# EAGLE design 500uH (EAGLE 9.6.2)
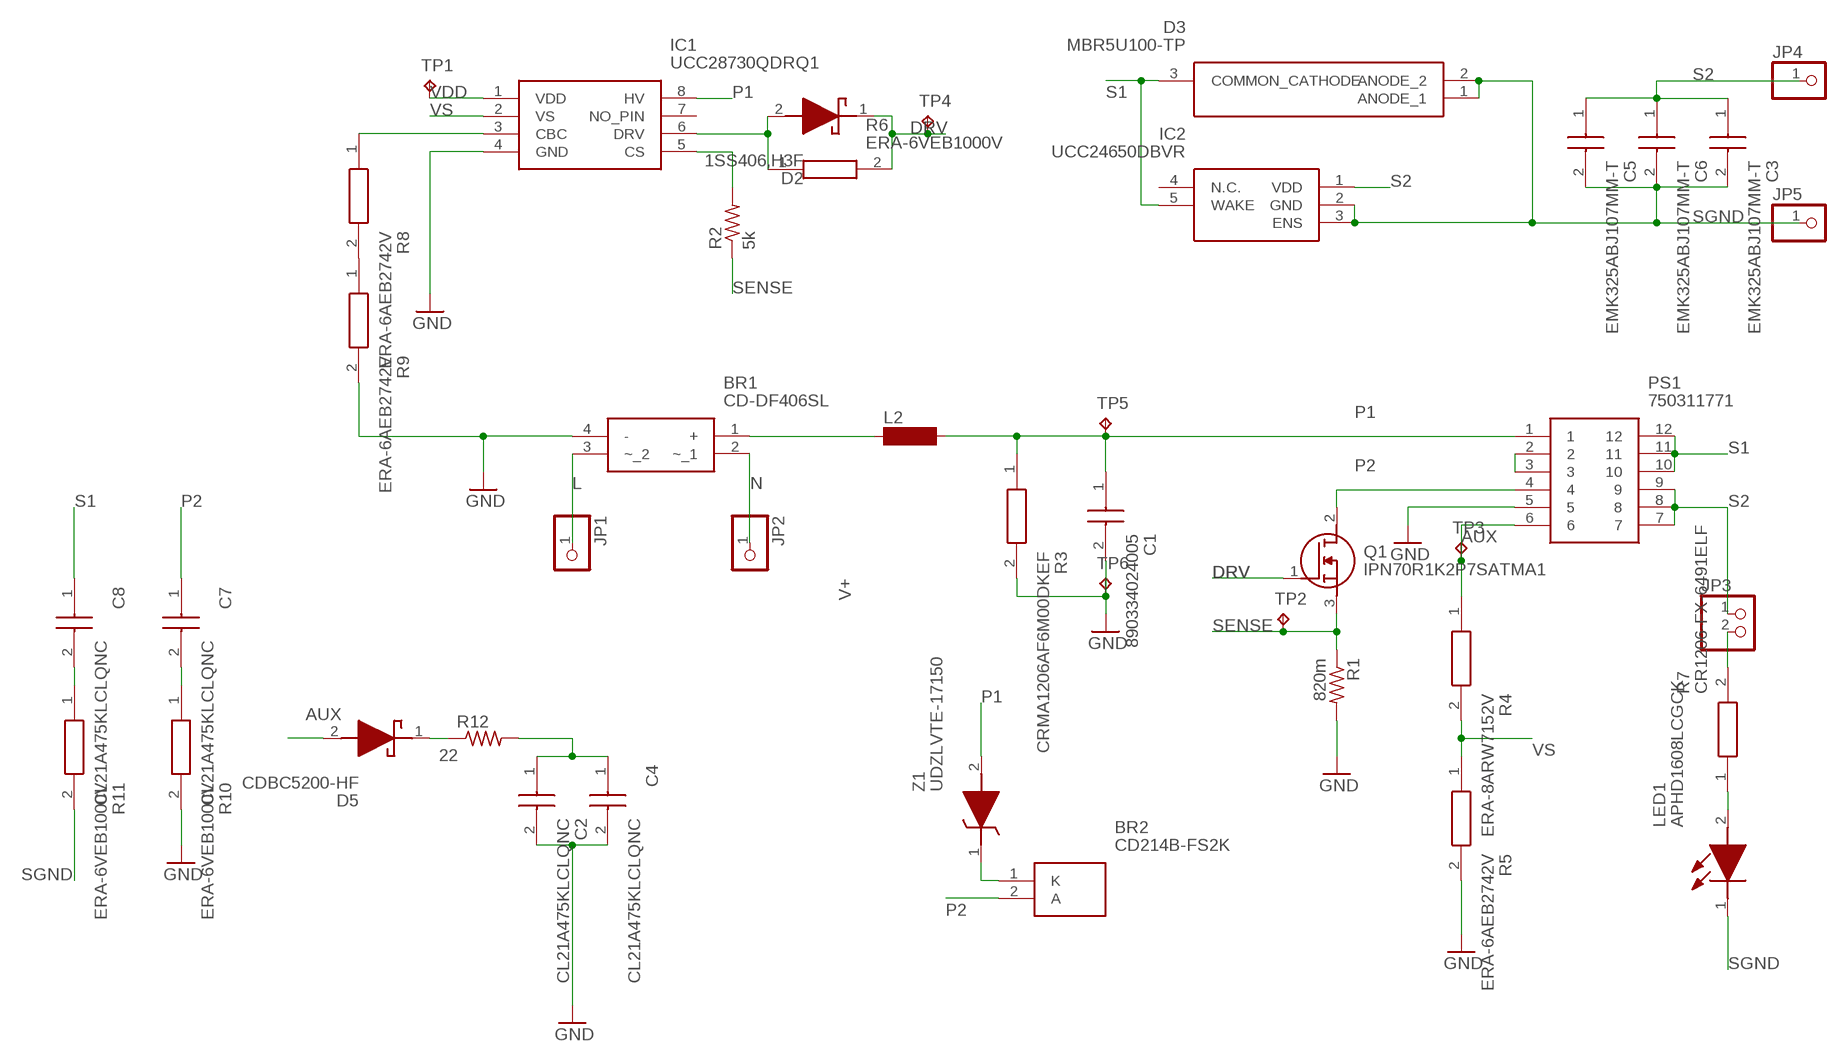
[diagram p0: schematic, sheet 1]

## Parts
BR1  CD-DF406SL  [CDDF406SL]
BR2  CD214B-FS2K  [CD214BFS2K]
C1  890334024005  [890334024005]
C2  CL21A475KLCLQNC  [CAPC2012X95N]
C3  EMK325ABJ107MM-T  [CAPC3225X270N]
C4  CL21A475KLCLQNC  [CAPC2012X95N]
C5  EMK325ABJ107MM-T  [CAPC3225X270N]
C6  EMK325ABJ107MM-T  [CAPC3225X270N]
C7  CL21A475KLCLQNC  [CAPC2012X95N]
C8  CL21A475KLCLQNC  [CAPC2012X95N]
D2  1SS406,H3F  [SOD2513X115N]
D3  MBR5U100-TP  [MBR5U100TP]
D5  CDBC5200-HF  [DIOM8059X290N]
IC1  UCC28730QDRQ1  [SOIC127P600X175-8N]
IC2  UCC24650DBVR  [SOT95P280X145-5N]
JP1  PINHD-1X1  [1X01]
JP2  PINHD-1X1  [1X01]
JP3  PINHD-1X2  [1X02]
JP4  PINHD-1X1  [1X01]
JP5  PINHD-1X1  [1X01]
L2  MS50SRU1048-471Y  [INDDFN1000X1000X480-2N]
LED1  APHD1608LCGCK  [LEDM168X80N]
PS1  750311771  [750311771]
Q1  IPN70R1K2P7SATMA1  [IPN70R1K2P7SATMA1]
R1  820m  R-US_R0805  [R0805]
R2  5k  R-US_R0805  [R0805]
R3  CRMA1206AF6M00DKEF  [RESC3216X74N]
R4  ERA-8ARW7152V  [ERA8A_(0805)]
R5  ERA-6AEB2742V  [ERA6A_(0805)]
R6  ERA-6VEB1000V  [ERA6VK]
R7  CR1206-FX-6491ELF  [RESC3216X75N]
R8  ERA-6AEB2742V  [ERA6A_(0805)]
R9  ERA-6AEB2742V  [ERA6A_(0805)]
R10  ERA-6VEB1000V  [ERA6VK]
R11  ERA-6VEB1000V  [ERA6VK]
R12  22  R-US_R0805  [R0805]
TP1  TPB1,27  [B1,27]
TP2  TPB1,27  [B1,27]
TP3  TPB1,27  [B1,27]
TP4  TPB1,27  [B1,27]
TP5  TPB1,27  [B1,27]
TP6  TPB1,27  [B1,27]
Z1  UDZLVTE-17150  [SODFL2512X90N]

## Nets
AUX: D5.2(A) PS1.6 R4.1 TP3.TP
DRV: D2.1(K) Q1.1(G) R6.2 TP4.TP
GND: BR1.4(-) C1.2 C2.2 C4.2 IC1.4(GND) PS1.5 R1.2 R3.2 R5.2 R9.2 R10.2 TP6.TP
L: BR1.3(~_2) JP1.1
N: BR1.2(~_1) JP2.1
N$1: IC1.5(CS) R2.2
N$2: C7.2 R10.1
N$3: C8.2 R11.1
N$4: D5.1(K) R12.1
N$5: PS1.2 PS1.3
N$6: BR2.1(K) Z1.1(K)
N$7: D2.2(A) IC1.6(DRV) R6.1
N$8: R8.2 R9.1
N$9: LED1.2(A) R7.1
N$10: IC1.3(CBC) R8.1
N$11: JP3.2 R7.2
P1: C1.1 IC1.8(HV) L2.2 PS1.1 R3.1 TP5.TP Z1.2(A)
P2: BR2.2(A) C7.1 PS1.4 Q1.2(D)
S1: C8.1 D3.3(COMMON_CATHODE) IC2.5(WAKE) PS1.10 PS1.11 PS1.12
S2: C3.1 C5.1 C6.1 IC2.1(VDD) JP3.1 JP4.1 PS1.7 PS1.8 PS1.9
SENSE: Q1.3(S) R1.1 R2.1 TP2.TP
SGND: C3.2 C5.2 C6.2 D3.1(ANODE_1) D3.2(ANODE_2) IC2.2(GND) IC2.3(ENS) JP5.1 LED1.1(K) R11.2
V+: BR1.1(+) L2.1
VDD: C2.1 C4.1 IC1.1(VDD) R12.2 TP1.TP
VS: IC1.2(VS) R4.2 R5.1
Unconnected: IC1.7(NO_PIN) IC2.4(N.C.)

## Library data of the parts
BR1 = CD-DF406SL:CD-DF406SL: Bridge Rectifiers VRRM 600V 4A SMD DFS Bridge Rectifier Source: Datasheet <http://www.bourns.com/docs/Product-Datasheets/CD-DF4xxSL.pdf>; DESCRIPTION: Bridge Rectifiers VRRM 600V 4A SMD DFS Bridge Rectifier; HEIGHT: 1.55mm; MANUFACTURER_NAME: Bourns; MANUFACTURER_PART_NUMBER: CD-DF406SL; MOUSER_PART_NUMBER: 652-CD-DF406SL; MOUSER_PRICE-STOCK: https://www.mouser.co.uk/ProductDetail/Bourns/CD-DF406SL?qs=zwwtnr6GuIwJRuaaRN0u3A%3D%3D
BR2 = CD214B-FS2K:CD214B-FS2K: Rectifiers 800V 2A Source: Datasheet <http://www.bourns.com/docs/product-datasheets/CD214B-FS2x.pdf>; DESCRIPTION: Rectifiers 800V 2A; HEIGHT: 1.25mm; MANUFACTURER_NAME: Bourns; MANUFACTURER_PART_NUMBER: CD214B-FS2K; MOUSER_PART_NUMBER: 652-CD214B-FS2K; MOUSER_PRICE-STOCK: https://www.mouser.co.uk/ProductDetail/Bourns/CD214B-FS2K?qs=f9yNj16SXrLQSBa%252BXyEv0g%3D%3D
C1 = 890334024005:890334024005: Wurth Elektronik 470nF Polypropylene Capacitor PP 310V ac +/-10% Tolerance WCAP-FTXX Series Source: Datasheet <https://katalog.we-online.de/pbs/datasheet/890334024005.pdf>; DESCRIPTION: Wurth Elektronik 470nF Polypropylene Capacitor PP 310V ac +/-10% Tolerance WCAP-FTXX Series; HEIGHT: 16.5mm; MANUFACTURER_NAME: Wurth Elektronik; MANUFACTURER_PART_NUMBER: 890334024005; MOUSER_PART_NUMBER: 710-890334024005; MOUSER_PRICE-STOCK: https://www.mouser.co.uk/ProductDetail/Wurth-Elektronik/890334024005?qs=pceeu5JH%2FH931a333DfnpQ%3D%3D
C2 C4 C7 C8 = CL21A475KLCLQNC:CL21A475KLCLQNC: CL21A475KLCLQNC Source: Datasheet <https://datasheet.datasheetarchive.com/originals/dk/DKDS-19/374306.pdf>; DESCRIPTION: CL21A475KLCLQNC; HEIGHT: 0.95mm; MANUFACTURER_NAME: SAMSUNG; MANUFACTURER_PART_NUMBER: CL21A475KLCLQNC; MOUSER_PART_NUMBER: 187-CL21A475KLCLQNC; MOUSER_PRICE-STOCK: https://www.mouser.co.uk/ProductDetail/Samsung-Electro-Mechanics/CL21A475KLCLQNC?qs=xZ%2FP%252Ba9zWqblbGH9u%2F3CcQ%3D%3D
C3 C5 C6 = EMK325ABJ107MM-T:EMK325ABJ107MM-T: TAIYO YUDEN - EMK325ABJ107MM-T - CAP, MLCC, X5R, 100UF, 16V, 1210 Source: Datasheet <https://componentsearchengine.com/Datasheets/2/EMK325ABJ107MM-T.pdf>; DESCRIPTION: TAIYO YUDEN - EMK325ABJ107MM-T - CAP, MLCC, X5R, 100UF, 16V, 1210; HEIGHT: 2.7mm; MANUFACTURER_NAME: TAIYO YUDEN; MANUFACTURER_PART_NUMBER: EMK325ABJ107MM-T; MOUSER_PART_NUMBER: 963-EMK325ABJ107MM-T; MOUSER_PRICE-STOCK: https://www.mouser.co.uk/ProductDetail/Taiyo-Yuden/EMK325ABJ107MM-T?qs=I6KAKw0tg2y0ShKbEoYruw%3D%3D
D2 = 1SS406_H3F:1SS406,H3F: Small Signal Schottky Barrier Diode VR=20V, IO=0.05A, in SOD-323 package Source: Datasheet <https://www.mouser.fr/datasheet/2/408/1SS406_datasheet_en_20140301-1853419.pdf>; DESCRIPTION: Small Signal Schottky Barrier Diode VR=20V, IO=0.05A, in SOD-323 package; HEIGHT: 1.15mm; MANUFACTURER_NAME: Toshiba; MANUFACTURER_PART_NUMBER: 1SS406,H3F; MOUSER_PART_NUMBER: 757-1SS406H3F; MOUSER_PRICE-STOCK: https://www.mouser.co.uk/ProductDetail/Toshiba/1SS406H3F?qs=bZr6mbWTK5l7KVDflTlTGA%3D%3D
D3 = MBR5U100-TP:MBR5U100-TP: Diode Schottky 100 V 5A Surface Mount TO-277 Source: Datasheet <https://www.mccsemi.com/pdf/Products/MBR5U100(TO-277).pdf>; DESCRIPTION: Diode Schottky 100 V 5A Surface Mount TO-277; HEIGHT: 1.2mm; MANUFACTURER_NAME: MCC; MANUFACTURER_PART_NUMBER: MBR5U100-TP
D5 = CDBC5200-HF:CDBC5200-HF: Diode 200 V 5A Surface Mount DO-214AB (SMC) Source: Datasheet <https://www.comchiptech.com/admin/files/product/CDBC5150-HF Thru913202. CDBC5200-HF RevB.pdf>; DESCRIPTION: Diode 200 V 5A Surface Mount DO-214AB (SMC); HEIGHT: 2.9mm; MANUFACTURER_NAME: Comchip Technology; MANUFACTURER_PART_NUMBER: CDBC5200-HF; MOUSER_PART_NUMBER: 750-CDBC5200-HF; MOUSER_PRICE-STOCK: https://www.mouser.co.uk/ProductDetail/Comchip-Technology/CDBC5200-HF?qs=XEIV%2Fho1H6e7FEPE4wQmfQ%3D%3D
IC1 = UCC28730QDRQ1:UCC28730QDRQ1: Zero-Power Standby PSR Flyback Controller for Automotive Source: Datasheet <http://www.ti.com/lit/gpn/ucc28730-q1>; DESCRIPTION: Zero-Power Standby PSR Flyback Controller for Automotive; HEIGHT: 1.75mm; MANUFACTURER_NAME: Texas Instruments; MANUFACTURER_PART_NUMBER: UCC28730QDRQ1; MOUSER_PART_NUMBER: 595-UCC28730QDRQ1; MOUSER_PRICE-STOCK: https://www.mouser.co.uk/ProductDetail/Texas-Instruments/UCC28730QDRQ1?qs=HXFqYaX1Q2wArPNWbLj35A%3D%3D
IC2 = UCC24650DBVR:UCC24650DBVR: 200-V Wake-up Monitor for Fast Transient Primary-side Regulation Source: Datasheet <http://www.ti.com/lit/gpn/ucc24650>; DESCRIPTION: 200-V Wake-up Monitor for Fast Transient Primary-side Regulation; HEIGHT: 1.45mm; MANUFACTURER_NAME: Texas Instruments; MANUFACTURER_PART_NUMBER: UCC24650DBVR; MOUSER_PART_NUMBER: 595-UCC24650DBVR; MOUSER_PRICE-STOCK: https://www.mouser.co.uk/ProductDetail/Texas-Instruments/UCC24650DBVR?qs=Lb6%252B0IsOw48DAHpAvVALpw%3D%3D
JP1 JP2 JP4 JP5 = adafruit:PINHD-1X1: Pin header 1x1 for 0.1" spacing With round pins
JP3 = pinhead:PINHD-1X2: PIN HEADER
L2 = inductor-neosid:MS50: INDUCTOR SMD power inductor
LED1 = APHD1608LCGCK:APHD1608LCGCK: Standard LEDs - SMD 0603 Dome Lens LED Green- 570nm Source: Datasheet <http://www.kingbrightusa.com/images/catalog/SPEC/APHD1608LCGCK.pdf>; DESCRIPTION: Standard LEDs - SMD 0603 Dome Lens LED Green- 570nm; HEIGHT: 0.8mm; MANUFACTURER_NAME: Kingbright; MANUFACTURER_PART_NUMBER: APHD1608LCGCK; MOUSER_PART_NUMBER: 604-APHD1608LCGCK; MOUSER_PRICE-STOCK: https://www.mouser.co.uk/ProductDetail/Kingbright/APHD1608LCGCK?qs=AQlKX63v8RvqPbV1LDSVuw%3D%3D
PS1 = 750311771:750311771: Power Transformers WE-FB Flyback 500uH 3A 15V Source: Datasheet <https://katalog.we-online.com/pbs/datasheet/750311771.pdf>; DESCRIPTION: Power Transformers WE-FB Flyback 500uH 3A 15V; HEIGHT: 13.69mm; MANUFACTURER_NAME: Wurth Elektronik; MANUFACTURER_PART_NUMBER: 750311771; MOUSER_PART_NUMBER: 710-750311771; MOUSER_PRICE-STOCK: https://www.mouser.co.uk/ProductDetail/Wurth-Elektronik/750311771?qs=J4sk5G6CMwYUnCXRsU%2FeCw%3D%3D; SPICEPREFIX: X
Q1 = IPN70R1K2P7SATMA1:IPN70R1K2P7SATMA1: N-Channel 700 V 4.5A (Tc) 6.3W (Tc) Surface Mount PG-SOT223 Source: Datasheet <https://www.infineon.com/dgdl/Infineon-IPN70R1K2P7S-DS-v02_00-EN.pdf?fileId=5546d4625f2e26bc015f524b972d6b74>; DESCRIPTION: N-Channel 700 V 4.5A (Tc) 6.3W (Tc) Surface Mount PG-SOT223; HEIGHT: 1.8mm; MANUFACTURER_NAME: Infineon; MANUFACTURER_PART_NUMBER: IPN70R1K2P7SATMA1; MOUSER_PART_NUMBER: 726-IPN70R1K2P7SATM1; MOUSER_PRICE-STOCK: https://www.mouser.co.uk/ProductDetail/Infineon-Technologies/IPN70R1K2P7SATMA1?qs=W0yvOO0ixfF5ZdsayOLPrw%3D%3D
R1 R2 R12 = adafruit:R-US_: RESISTOR, American symbol
R3 = CRMA1206AF6M00DKEF:CRMA1206AF6M00DKEF: Thick Film Resistors - SMD 0.30W 6Mohm .5% AEC-Q200 Source: Datasheet <https://www.vishay.com/doc?68043>; DESCRIPTION: Thick Film Resistors - SMD 0.30W 6Mohm .5% AEC-Q200; HEIGHT: 0.74mm; MANUFACTURER_NAME: Vishay; MANUFACTURER_PART_NUMBER: CRMA1206AF6M00DKEF
R4 = ERA-8ARW7152V:ERA-8ARW7152V: Thin Film Resistors - SMD 1206 71.5Kohms 0.05% 0.25W 10ppm AEC-Q200 Source: Datasheet <https://componentsearchengine.com/Datasheets/1/ERA-8ARW7152V.pdf>; DESCRIPTION: Thin Film Resistors - SMD 1206 71.5Kohms 0.05% 0.25W 10ppm AEC-Q200; HEIGHT: 0.7mm; MANUFACTURER_NAME: Panasonic; MANUFACTURER_PART_NUMBER: ERA-8ARW7152V; MOUSER_PART_NUMBER: 667-ERA-8ARW7152V; MOUSER_PRICE-STOCK: https://www.mouser.com/Search/Refine.aspx?Keyword=667-ERA-8ARW7152V
R5 R8 R9 = ERA-6AEB2742V:ERA-6AEB2742V: Thin Film Resistors - SMD 0805 27.4Kohm 0.1% 25ppm Source: Datasheet <http://industrial.panasonic.com/cdbs/www-data/pdf/RDM0000/AOA0000C307.pdf>; DESCRIPTION: Thin Film Resistors - SMD 0805 27.4Kohm 0.1% 25ppm; HEIGHT: 0.6mm; MANUFACTURER_NAME: Panasonic; MANUFACTURER_PART_NUMBER: ERA-6AEB2742V; MOUSER_PART_NUMBER: 667-ERA-6AEB2742V; MOUSER_PRICE-STOCK: https://www.mouser.co.uk/ProductDetail/Panasonic/ERA-6AEB2742V?qs=nuXzIS8loXHdFK0i8oIpgw%3D%3D
R6 R10 R11 = ERA-6VEB1000V:ERA-6VEB1000V: Thin Film Chip Resistor, High Stability & Reliability, 0805, 0.25W Source: Datasheet <http://industrial.panasonic.com/cdbs/www-data/pdf/RDM0000/RDM0000C331.pdf>; DESCRIPTION: Thin Film Chip Resistor, High Stability & Reliability, 0805, 0.25W; HEIGHT: 0.65mm; MANUFACTURER_NAME: Panasonic; MANUFACTURER_PART_NUMBER: ERA-6VEB1000V; MOUSER_PART_NUMBER: 667-ERA-6VEB1000V; MOUSER_PRICE-STOCK: https://www.mouser.co.uk/ProductDetail/Panasonic/ERA-6VEB1000V?qs=rI7uf1IzohT7rLgO%252BB7NcQ%3D%3D
R7 = CR1206-FX-6491ELF:CR1206-FX-6491ELF: Thick Film Resistors - SMD 6.49K 1% Source: Datasheet <https://componentsearchengine.com/Datasheets/1/CR1206-FX-6491ELF.pdf>; DESCRIPTION: Thick Film Resistors - SMD 6.49K 1%; HEIGHT: 0.75mm; MANUFACTURER_NAME: Bourns; MANUFACTURER_PART_NUMBER: CR1206-FX-6491ELF; MOUSER_PART_NUMBER: 652-CR1206FX-6491ELF; MOUSER_PRICE-STOCK: https://www.mouser.com/Search/Refine.aspx?Keyword=652-CR1206FX-6491ELF
TP1-TP6 = testpad:TP: Test pad
Z1 = UDZLVTE-17150:UDZLVTE-17150: ROHM - UDZLVTE-17150 - Zener Single Diode, 150 V, 200 mW, SOD-323FL, 2 Pins, 150 C Source: Datasheet <https://componentsearchengine.com/Datasheets/2/UDZLVTE-17150.pdf>; DESCRIPTION: ROHM - UDZLVTE-17150 - Zener Single Diode, 150 V, 200 mW, SOD-323FL, 2 Pins, 150 C; HEIGHT: 0.9mm; MANUFACTURER_NAME: ROHM Semiconductor; MANUFACTURER_PART_NUMBER: UDZLVTE-17150; MOUSER_PART_NUMBER: 755-UDZLVTE-17150; MOUSER_PRICE-STOCK: https://www.mouser.co.uk/ProductDetail/ROHM-Semiconductor/UDZLVTE-17150/?qs=uPV7ZbtEjc5dJhqDrwh%252BYA%3D%3D

## Board
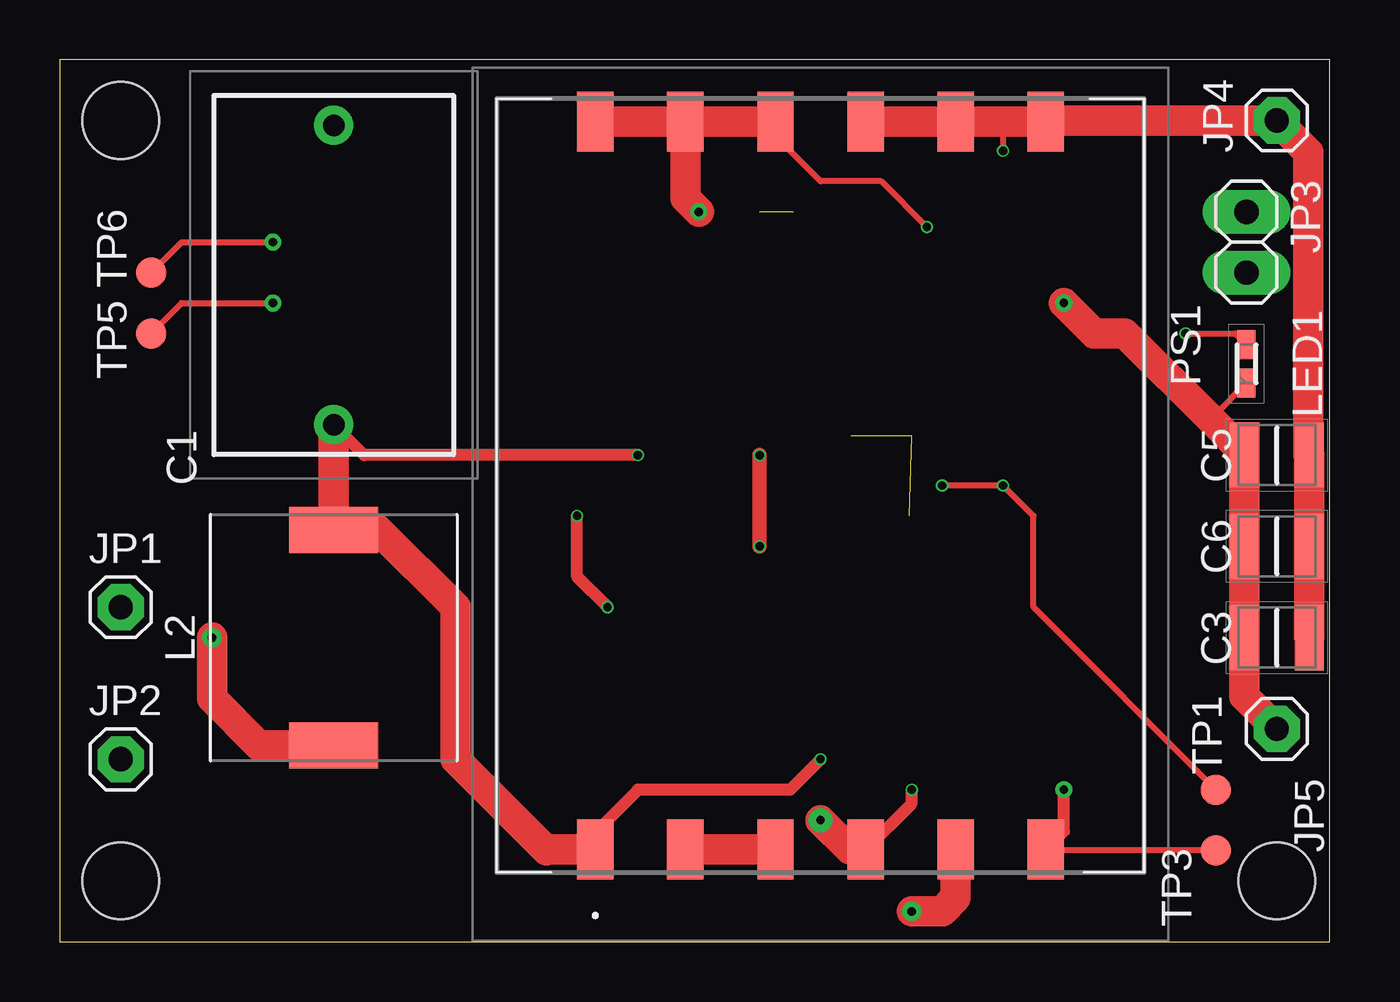
[diagram p1: board, top side]
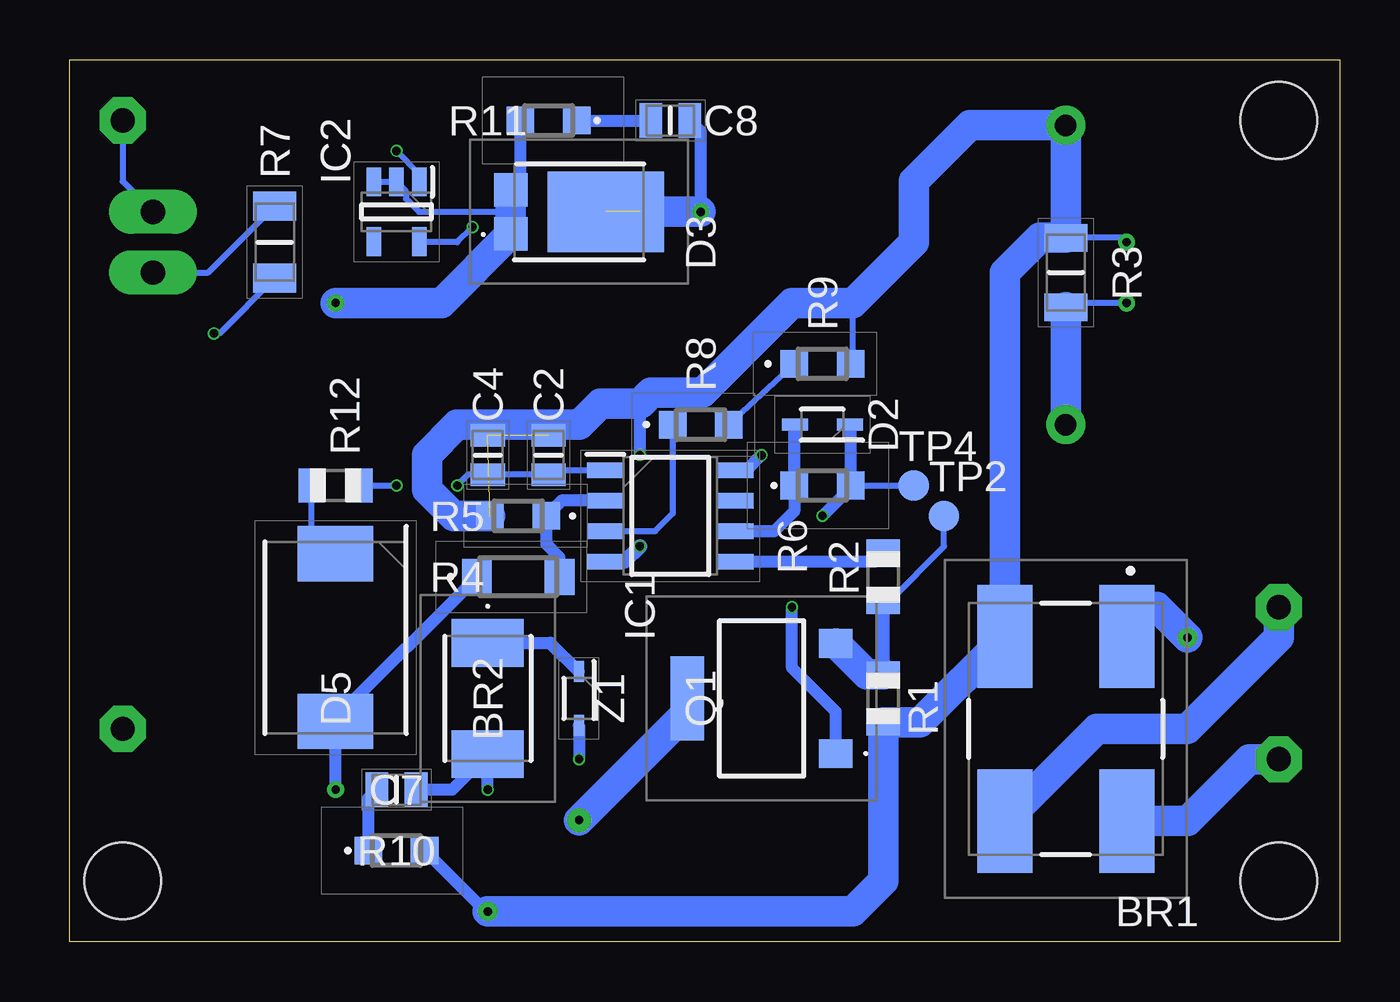
[diagram p2: board, bottom side, seen from below]

Size 53.01 x 36.82 mm. Coordinates in mm from the lower left corner, seen from the top.
Outline: 0,0 53.01,0 53.01,36.82 0,36.82 0,0
Copper layers (1*16): Top 0.035mm / dielectric 1.6mm / Bottom 0.035mm
Design rules "jlcpcb-2layers": minimum track width 5mil, minimum drill 0.3mm, track to track 5mil, track to pad 5mil, pad to pad 5mil, via to via 5mil, smd to smd 5mil, copper to edge 0.2mm, drill to drill 6mil, minimum pad ring 10mil, minimum via ring 3mil, stop-mask expansion 4mil, vias tented up to drill 0mil, thermal gap 10mil
Holes 3.2 mm at 2.54,34.29 50.8,2.54 2.54,2.54

### Footprints (pad centres in the part's own frame; a part is rotated, then mirrored left to right if it is on the bottom)
CDDF406SL = smd 2.3 x 4.3: 1 2.55,3.85; 2 2.55,-3.85; 3 -2.55,-3.85; 4 -2.55,3.85
CD214BFS2K = smd 2 x 3: 1 -2.325,0; 2 2.325,0
890334024005 = drill 0.9 pad 1.4: 1 0,0; 2 12.5,0
CAPC2012X95N = smd 0.94 x 1.43: 1 -0.82,0; 2 0.82,0
CAPC3225X270N = smd 1.22 x 2.72: 1 -1.35,0; 2 1.35,0
SOD2513X115N = smd 1.075 x 0.5: 1 -1.15,0; 2 1.15,0
MBR5U100TP = smd 1.4 x 1.4: 1 -2.855,-0.92; 2 -2.855,0.92 | smd 4.86 x 3.36: 3 1.125,0
DIOM8059X290N = smd 2.3 x 3.15: 1 -3.5,0; 2 3.5,0
SOIC127P600X175-8N = smd 1.528 x 0.65: 1 -2.711,1.905; 2 -2.711,0.635; 3 -2.711,-0.635; 4 -2.711,-1.905; 5 2.711,-1.905; 6 2.711,-0.635; 7 2.711,0.635; 8 2.711,1.905
SOT95P280X145-5N = smd 1.2 x 0.6: 1 -1.25,0.95; 2 -1.25,0; 3 -1.25,-0.95; 4 1.25,-0.95; 5 1.25,0.95
1X01 = drill 1.016 pad 1.93 octagon: 1 0,0
1X02 = drill 1.016 long: 1 -1.27,0; 2 1.27,0
INDDFN1000X1000X480-2N = smd 1.91 x 3.7: 1 -4.495,0; 2 4.495,0
LEDM168X80N = smd 1.2 x 0.75: 1 -0.8,0; 2 0.8,0
750311771 = smd 2.5 x 1.52: 1 -15.19,9.4; 2 -15.19,5.64; 3 -15.19,1.88; 4 -15.19,-1.88; 5 -15.19,-5.64; 6 -15.19,-9.4; 7 15.19,-9.4; 8 15.19,-5.64; 9 15.19,-1.88; 10 15.19,1.88; 11 15.19,5.64; 12 15.19,9.4
IPN70R1K2P7SATMA1 = smd 1.2 x 1.4: 1 -2.3,-3.1; 3 2.3,-3.1 | smd 3.5 x 1.4: 2 0,3.1
R0805 = smd 1.1 x 1.4: 1 -1,0; 2 1,0
RESC3216X74N = smd 1.15 x 1.8: 1 -1.45,0; 2 1.45,0
ERA8A_(0805) = smd 1.25 x 1.5: 1 -1.725,0; 2 1.725,0
ERA6A_(0805) = smd 1.15 x 1.15: 1 -1.175,0; 2 1.175,0
ERA6VK = smd 1.15 x 1.15: 1 -1.175,0; 2 1.175,0
RESC3216X75N = smd 1.2 x 1.8: 1 -1.5,0; 2 1.5,0
B1,27 = smd 1.27 x 1.27: TP 0,0
SODFL2512X90N = smd 0.87 x 0.42: 1 -1.125,0; 2 1.125,0

### Placement (x,y rotation side)
BR1  11.43,8.89 0 bottom
BR2  35.56,10.16 270 bottom
C1  11.43,21.59 90 top
C2  33.02,20.32 90 bottom
C3  50.8,12.7 180 top
C4  35.56,20.32 90 bottom
C5  50.8,20.32 180 top
C6  50.8,16.51 180 top
C7  39.37,6.35 180 bottom
C8  27.94,34.29 180 bottom
D2  21.59,21.59 180 bottom
D3  31.75,30.48 0 bottom
D5  41.91,12.7 270 bottom
IC1  27.94,17.78 0 bottom
IC2  39.37,30.48 270 bottom
JP1  2.54,13.97 0 top
JP2  2.54,7.62 0 top
JP3  49.53,29.21 270 top
JP4  50.8,34.29 0 top
JP5  50.8,8.89 0 top
L2  11.43,12.7 90 top
LED1  49.53,24.13 90 top
PS1  31.75,19.05 90 top
Q1  24.13,10.16 90 bottom
R1  19.05,10.16 270 bottom
R2  19.05,15.24 90 bottom
R3  11.43,27.94 90 bottom
R4  34.29,15.24 0 bottom
R5  34.29,17.78 180 bottom
R6  21.59,19.05 0 bottom
R7  44.45,29.21 90 bottom
R8  26.67,21.59 0 bottom
R9  21.59,24.13 0 bottom
R10  39.37,3.81 0 bottom
R11  33.02,34.29 180 bottom
R12  41.91,19.05 0 bottom
TP1  48.26,6.35 0 top
TP2  16.51,17.78 0 bottom
TP3  48.26,3.81 0 top
TP4  17.78,19.05 0 bottom
TP5  3.81,25.4 0 top
TP6  3.81,27.94 0 top
Z1  31.75,10.16 270 bottom

### Tracks (layer width: path | path; a pad name or v marks a point on that pad's centre or on a via)
AUX  (via drill 0.35 pad 0.7)
  Top 0.254: TP3.TP 41.2,3.81 PS1.6
  Top 0.508: PS1.6 41.91,4.62 v41.91,6.35
  Bottom 0.508: R4.1 41.91,9.35 D5.2 v41.91,6.35
DRV  (via drill 0.35)
  Top 0.508: v22.86,13.97 21.59,15.24 v21.59,17.78
  Bottom 0.254: R6.2 TP4.TP
  Bottom 0.508: D2.1 20.41,21.57 R6.2 20.41,18.95 v21.59,17.78 | Q1.1 21.03,9.6 22.86,11.43 v22.86,13.97
GND  (via drill 0.35, 0.35 pad 0.7, 0.35 pad 0.8)  (2 unrouted)
  Top 0.254: TP6.TP 5.08,29.21 v8.89,29.21
  Top 0.61: v29.21,16.51 v29.21,20.32
  Top 1.27: PS1.5 37.39,1.83 36.83,1.27 v35.56,1.27
  Bottom 0.254: R9.2 20.32,24.23 20.32,26.67 | v8.89,29.21 9.07,29.39 R3.2
  Bottom 0.508: v29.21,20.32 29.21,22.19 29.5,22.48 | R10.2 35.66,1.27 v35.56,1.27
  Bottom 0.61: IC1.4 29.84,15.88 v29.21,16.51
  Bottom 1.27: R5.2 36.99,17.78 38.1,18.89 38.1,20.32 36.83,21.59 31.74,21.59 30.85,22.48 29.5,22.48 29.18,22.48 28.74,22.93 26.6,22.93 22.86,26.67 20.32,26.67 17.78,29.21 17.78,31.75 15.44,34.09 C1.2 R3.2 12.52,29.39 13.98,27.93 BR1.4 13.98,12.69 17.51,9.16 R1.2 19.05,2.54 20.32,1.27 v35.56,1.27
L
  Bottom 1.27: BR1.3 10.13,8.89 6.35,8.89 2.54,12.7 JP1.1
N
  Bottom 1.27: BR1.2 6.34,5.04 3.76,7.62 JP2.1
N$1
  Bottom 0.508: IC1.5 19.41,15.88 R2.2
N$2
  Bottom 0.508: C7.2 40.55,6 R10.1
N$3
  Bottom 0.508: R11.1 C8.2
N$4
  Bottom 0.254: D5.1 42.91,17.2 R12.1
N$5
  Top 1.27: PS1.2 PS1.3
N$6
  Bottom 0.508: BR2.1 32.95,12.48 Z1.1
N$7
  Bottom 0.508: D2.2 22.77,21.57 R6.1 22.77,17.98 23.6,17.14 IC1.6
N$8
  Bottom 0.254: R8.2 25.5,21.6 R9.1
N$9  (via drill 0.35)
  Top 0.254: v46.99,25.4 49.06,25.4 LED1.2
  Bottom 0.254: R7.1 46.76,25.4 v46.99,25.4
N$10
  Bottom 0.254: R8.1 27.84,17.88 28.57,17.14 IC1.3
N$11
  Bottom 0.254: JP3.2 47.22,27.94 R7.2
P1  (via drill 0.35, 0.35 pad 0.7)
  Top 0.254: TP5.TP 5.08,26.67 v8.89,26.67
  Top 0.508: v31.75,7.62 30.48,6.35 24.13,6.35 22.35,4.57 PS1.1 | C1.1 12.7,20.32 v24.13,20.32
  Top 1.27: PS1.1 20.37,3.86 20.32,3.81 16.51,7.62 16.51,13.97 13.29,17.2 L2.2 C1.1
  Bottom 0.254: v8.89,26.67 11.25,26.67 R3.1
  Bottom 0.508: Z1.2 v31.75,7.62 | IC1.8 24.77,19.68 v24.13,20.32
  Bottom 1.27: R3.1 C1.1
P2  (via drill 0.35, 0.35 pad 1)
  Top 0.508: PS1.4 35.56,5.79 v35.56,6.35
  Top 1.27: PS1.4 32.97,3.86 v31.75,5.08
  Bottom 0.508: v35.56,6.35 BR2.2 37.05,6.35 C7.1
  Bottom 1.27: Q1.2 27.23,9.6 v31.75,5.08
S1  (via drill 0.35, 0.35 pad 0.7)  (1 unrouted)
  Top 0.254: v36.2,29.84 34.29,31.75 31.75,31.75 29.87,33.63 PS1.10
  Top 1.27: PS1.12 PS1.11 | PS1.10 PS1.11 | PS1.11 26.11,31.04 v26.67,30.48
  Bottom 0.254: IC2.5 36.85,29.23 36.83,29.21 v36.2,29.84
  Bottom 0.508: C8.1 26.67,33.84 v26.67,30.48
  Bottom 1.27: v26.67,30.48 29.21,30.48
S2  (via drill 0.35)
  Top 0.254: 39.37,34.24 v39.37,33.02
  Top 1.27: PS1.9 PS1.8 39.37,34.24 PS1.7 41.2,34.29 JP4.1 52.12,32.97 52.12,20.35 C5.1 C6.1 C3.1
  Bottom 0.254: IC2.1 38.4,31.75 38.4,32.05 v39.37,33.02 | JP4.1 50.8,31.75 JP3.1
SENSE
  Bottom 0.254: R2.1 18.78,14.24 16.51,16.51 TP2.TP
  Bottom 0.508: R2.1 R1.1
  Bottom 1.27: Q1.3 19.73,11.16 R1.1
SGND  (via drill 0.35 pad 0.7)
  Top 0.254: LED1.1 48.18,21.98 48.18,21.67
  Top 1.27: JP5.1 49.45,10.24 C3.2 C6.2 C5.2 49.45,20.4 48.18,21.67 44.45,25.4 43.18,25.4 v41.91,26.67
  Bottom 0.254: IC2.3 IC2.2 38.97,31.33 38.97,31.02 38.43,30.48 34.6,30.48
  Bottom 0.508: D3.2 34.2,31.81 R11.2
  Bottom 1.27: D3.2 34.6,30.48 D3.1 37.49,26.67 v41.91,26.67
V+  (via drill 0.35 pad 0.8)
  Top 1.27: L2.1 8.3,8.21 6.35,10.16 v6.35,12.7
  Bottom 1.27: v6.35,12.7 7.62,13.97 8.89,13.97 BR1.1
VDD  (via drill 0.35)
  Top 0.254: v36.83,19.05 v39.37,19.05 40.64,17.78 40.64,13.97 TP1.TP
  Bottom 0.254: IC1.1 32.84,19.68 C2.1 C4.1 36.38,19.5 v36.83,19.05 | R12.2 v39.37,19.05
VS
  Bottom 0.508: IC1.2 32.48,18.41 R5.1 33.12,16.61 32.56,16.05 R4.2